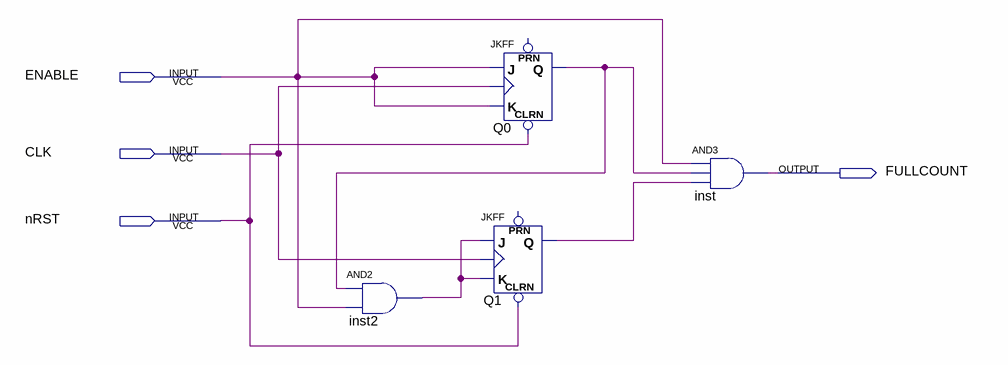
[diagram p0: schematic sheet]
// Quartus schematic ContadorCiclos4.bdf as structural Verilog: 4 symbols, 4 pins
module ContadorCiclos4 (
  input  ENABLE,
  input  CLK,
  input  nRST,
  output FULLCOUNT
);

  wire inst2_out, Q0_q, Q1_q;

  and inst2 (inst2_out, Q0_q, ENABLE);
  JKFF Q0 (.CLRN(nRST), .K(ENABLE), .J(ENABLE), .CLK(CLK), .Q(Q0_q));  // open: PRN
  JKFF Q1 (.CLRN(nRST), .K(inst2_out), .J(inst2_out), .CLK(CLK), .Q(Q1_q));  // open: PRN
  and inst (FULLCOUNT, ENABLE, Q0_q, Q1_q);
endmodule
